# Altium schematic sheet Digital_SRAM.SchDoc
size A
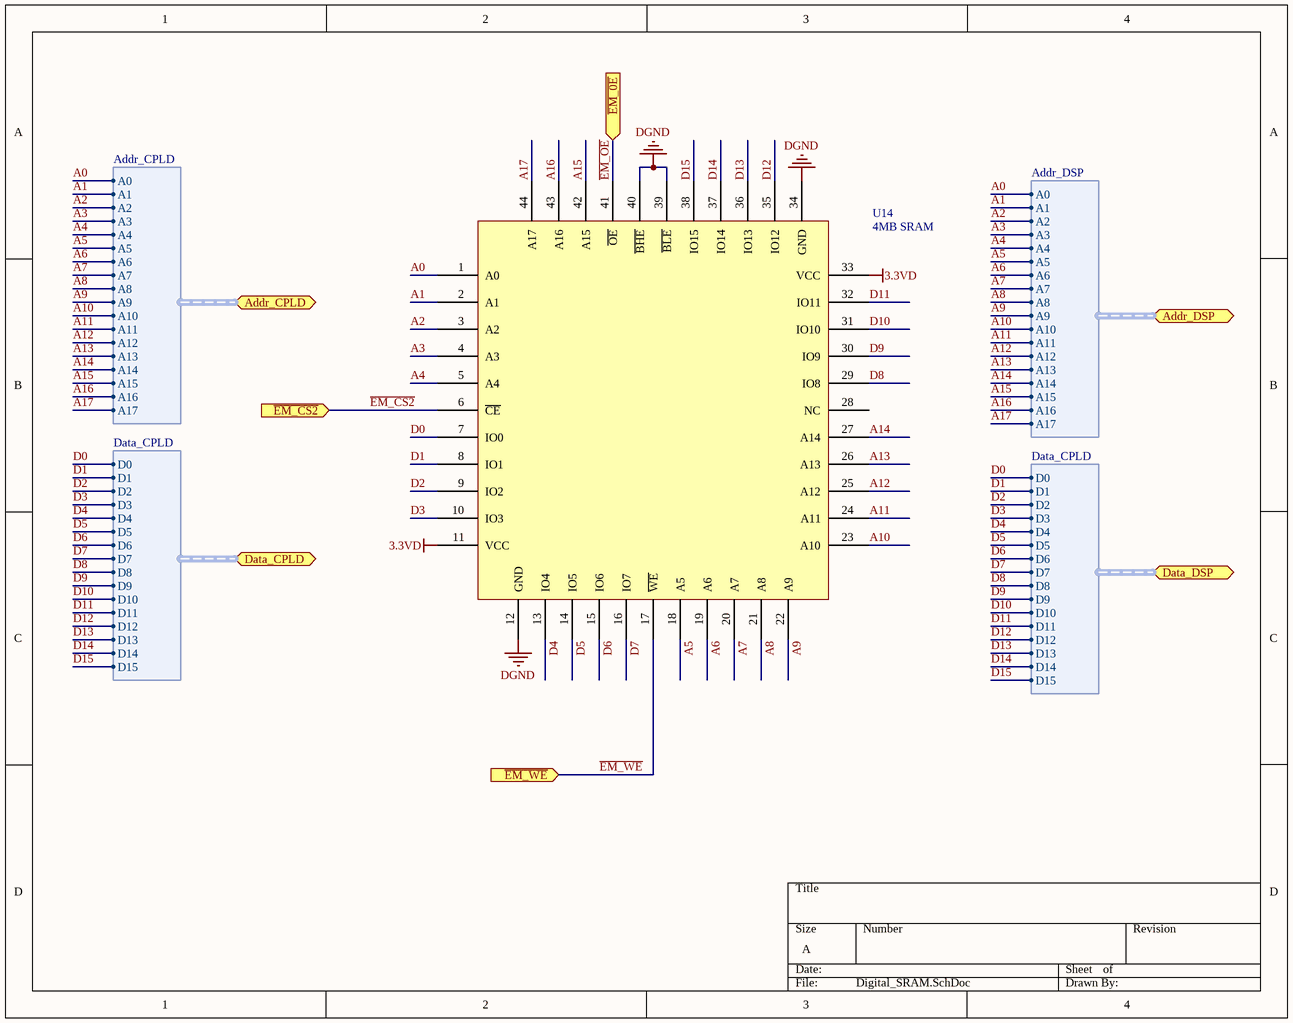
[diagram p0: Digital_SRAM.SchDoc]

## Parts
U14  4MB SRAM  [TSOP-44]

## Ports
Addr_CPLD (harness Addr_CPLD), Addr_DSP (harness Addr_DSP), Data_CPLD (harness Data_CPLD), Data_DSP (harness Data_CPLD), ~{EM_0E} (in), ~{EM_CS2} (in), ~{EM_WE} (in)

## Harnesses
Addr_CPLD: A0, A1, A2, A3, A4, A5, A6, A7, A8, A9, A10, A11, A12, A13, A14, A15, A16, A17
Data_CPLD: D0, D1, D2, D3, D4, D5, D6, D7, D8, D9, D10, D11, D12, D13, D14, D15
Addr_DSP: A0, A1, A2, A3, A4, A5, A6, A7, A8, A9, A10, A11, A12, A13, A14, A15, A16, A17

## Nets
3.3VD: U14.11(VCC) U14.33(VCC)
DGND: U14.12(GND) U14.34(GND) U14.39(~{BLE}) U14.40(~{BHE})
A0: U14.1(A0) ; port Addr_CPLD.A0, port Addr_DSP.A0
A1: U14.2(A1) ; port Addr_CPLD.A1, port Addr_DSP.A1
A2: U14.3(A2) ; port Addr_CPLD.A2, port Addr_DSP.A2
A3: U14.4(A3) ; port Addr_CPLD.A3, port Addr_DSP.A3
A4: U14.5(A4) ; port Addr_CPLD.A4, port Addr_DSP.A4
A5: U14.18(A5) ; port Addr_CPLD.A5, port Addr_DSP.A5
A6: U14.19(A6) ; port Addr_CPLD.A6, port Addr_DSP.A6
A7: U14.20(A7) ; port Addr_CPLD.A7, port Addr_DSP.A7
A8: U14.21(A8) ; port Addr_CPLD.A8, port Addr_DSP.A8
A9: U14.22(A9) ; port Addr_CPLD.A9, port Addr_DSP.A9
A10: U14.23(A10) ; port Addr_CPLD.A10, port Addr_DSP.A10
A11: U14.24(A11) ; port Addr_CPLD.A11, port Addr_DSP.A11
A12: U14.25(A12) ; port Addr_CPLD.A12, port Addr_DSP.A12
A13: U14.26(A13) ; port Addr_CPLD.A13, port Addr_DSP.A13
A14: U14.27(A14) ; port Addr_CPLD.A14, port Addr_DSP.A14
A15: U14.42(A15) ; port Addr_CPLD.A15, port Addr_DSP.A15
A16: U14.43(A16) ; port Addr_CPLD.A16, port Addr_DSP.A16
A17: U14.44(A17) ; port Addr_CPLD.A17, port Addr_DSP.A17
D0: U14.7(IO0) ; port Data_CPLD.D0, port Data_DSP.D0
D1: U14.8(IO1) ; port Data_CPLD.D1, port Data_DSP.D1
D2: U14.9(IO2) ; port Data_CPLD.D2, port Data_DSP.D2
D3: U14.10(IO3) ; port Data_CPLD.D3, port Data_DSP.D3
D4: U14.13(IO4) ; port Data_CPLD.D4, port Data_DSP.D4
D5: U14.14(IO5) ; port Data_CPLD.D5, port Data_DSP.D5
D6: U14.15(IO6) ; port Data_CPLD.D6, port Data_DSP.D6
D7: U14.16(IO7) ; port Data_CPLD.D7, port Data_DSP.D7
D8: U14.29(IO8) ; port Data_CPLD.D8, port Data_DSP.D8
D9: U14.30(IO9) ; port Data_CPLD.D9, port Data_DSP.D9
D10: U14.31(IO10) ; port Data_CPLD.D10, port Data_DSP.D10
D11: U14.32(IO11) ; port Data_CPLD.D11, port Data_DSP.D11
D12: U14.35(IO12) ; port Data_CPLD.D12, port Data_DSP.D12
D13: U14.36(IO13) ; port Data_CPLD.D13, port Data_DSP.D13
D14: U14.37(IO14) ; port Data_CPLD.D14, port Data_DSP.D14
D15: U14.38(IO15) ; port Data_CPLD.D15, port Data_DSP.D15
~{EM_CS2}: U14.6(~{CE}) ; port ~{EM_CS2}
~{EM_OE}: U14.41(~{OE}) ; port ~{EM_0E}
~{EM_WE}: U14.17(~{WE}) ; port ~{EM_WE}

Not connected (* = marked no-connect by the designer): U14 28(NC)

## Library data of the parts
U14 = CY7C1041CV33-8ZSXI: IC SRAM 4MBIT 8NS 44TSOP; Supplier 1: Digi-Key; Supplier Part Number 1: 428-3284-ND